# EAGLE design placamaxpequena (EAGLE 7.7.0)
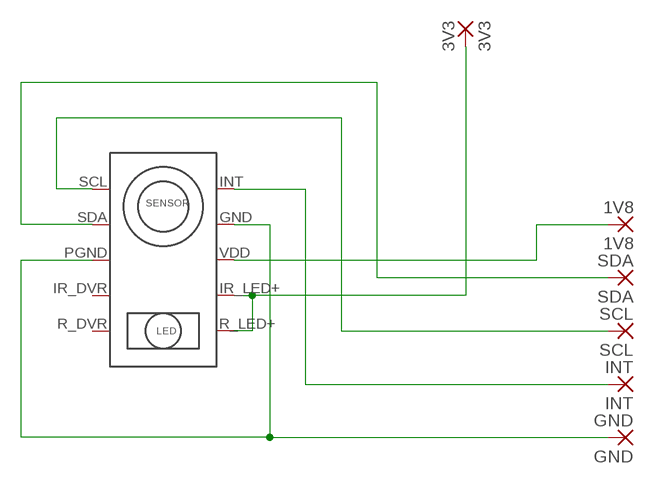
[diagram p0: schematic, sheet 1]

## Parts
1V8  1V8  WIREPADSMD1,27-254  [SMD1,27-2,54]
3V3  3V3  WIREPADSMD1,27-254  [SMD1,27-2,54]
GND  GND  WIREPADSMD1,27-254  [SMD1,27-2,54]
INT  INT  WIREPADSMD1,27-254  [SMD1,27-2,54]
SCL  SCL  WIREPADSMD1,27-254  [SMD1,27-2,54]
SDA  SDA  WIREPADSMD1,27-254  [SMD1,27-2,54]
U$1  MAX30100  [SOIC14]

## Nets
1V8: 1V8.1(P) U$1.VDD
3V3: 3V3.1(P) U$1.IR_LED+ U$1.R_LED+
GND: GND.1(P) U$1.GND U$1.PGND
INT: INT.1(P) U$1.INT
SCL: SCL.1(P) U$1.SCL
SDA: SDA.1(P) U$1.SDA
Unconnected: U$1.IR_DVR U$1.R_DVR

## Library data of the parts
1V8 3V3 GND INT SCL SDA = wirepad:WIREPAD: Wire PAD connect wire on PCB
U$1 = max30100:MAX30100: Ciruito integrado MAX30100.

## Board
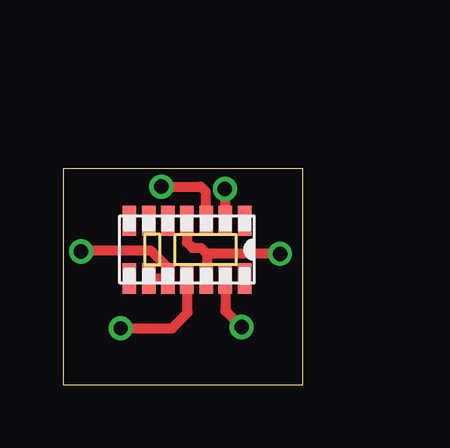
[diagram p1: board, top side]
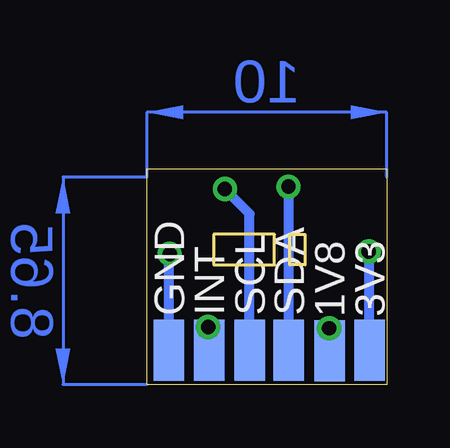
[diagram p2: board, bottom side, seen from below]

Size 10 x 9 mm. Coordinates in mm from the lower left corner, seen from the top.
Outline: 0,0 10,0 10,9 0,9 0,0
Copper layers (1*16): Top 0.035mm / dielectric 1.5mm / Bottom 0.035mm
Design rules "default *": minimum track width 10mil, minimum drill 24mil, track to track 1mil, track to pad 1mil, pad to pad 1mil, via to via 1mil, smd to smd 1mil, copper to edge 1mil, drill to drill 1mil, minimum pad ring 10mil, minimum via ring 8mil, stop-mask expansion 4mil, vias tented up to drill 0mil, thermal gap 10mil

### Footprints (pad centres in the part's own frame; a part is rotated, then mirrored left to right if it is on the bottom)
SMD1,27-2,54 = smd 1.27 x 2.54: 1 0,0
SOIC14 = smd 1.27 x 0.559: GND -0.71,-1.88; INT -0.71,-1.08; IR_DVR -3.11,-3.48; IR_LED+ -0.71,-3.48; NC1 -3.11,-0.28; NC2 -3.11,-5.08; NC3 -0.71,-5.08; NC4 -0.71,-0.28; PGND -3.11,-2.68; R_DVR -3.11,-4.28; R_LED+ -0.71,-4.28; SCL -3.11,-1.08; SDA -3.11,-1.88; VDD -0.71,-2.68

### Placement (x,y rotation side)
1V8  2.39,1.41 0 bottom
3V3  0.72,1.44 0 bottom
GND  9.08,1.43 0 bottom
INT  7.41,1.43 0 bottom
SCL  5.72,1.43 0 bottom
SDA  4.08,1.43 0 bottom
U$1  7.85,3.72 270 top

### Tracks (layer width: path | path; a pad name or v marks a point on that pad's centre or on a via)
1V8  (via drill 0.6)
  Top 0.406: v2.4,2.35 4.55,2.35 5.2,3 5.2,4.4 U$1.VDD
  Bottom 0.406: 1V8.1 v2.39,2.34 v2.4,2.35
3V3  (via drill 0.6)
  Top 0.406: U$1.R_LED+ U$1.IR_LED+ 4.37,4.88 3.65,5.6 0.8,5.6 v0.75,5.55
  Bottom 0.406: 3V3.1 0.72,5.52 v0.75,5.55
GND  (via drill 0.6)
  Top 0.406: U$1.PGND 5.17,5.93 5.4,5.7 5.75,5.7 6,5.45 | 6,5.45 6,4.46 U$1.GND | v9.05,5.45 6,5.45
  Bottom 0.406: GND.1 9.08,5.43 v9.05,5.45
INT  (via drill 0.6)
  Top 0.406: U$1.INT 6.77,3.08 v7.45,2.4
  Bottom 0.406: v7.45,2.4 7.45,1.57 INT.1
SCL  (via drill 0.6)
  Top 0.406: v6.75,8.15 6.75,6.85 U$1.SCL
  Bottom 0.406: SCL.1 5.72,7.12 v6.75,8.15
SDA  (via drill 0.6)
  Top 0.406: v4.1,8.25 5.75,8.25 5.95,8.05 5.95,6.85 U$1.SDA
  Bottom 0.406: SDA.1 4.08,8.23 v4.1,8.25
(copper drawn outside any net)
  shapes: Bottom area x2